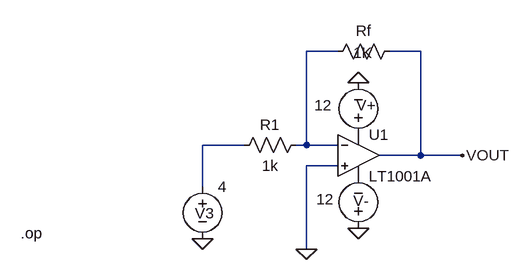
[diagram p0: schematic Inverting Amplifier.asc]
Inverting Amplifier.asc, the LTspice schematic file:
Version 4
SHEET 1 880 680
WIRE 224 16 176 16
WIRE 352 16 304 16
WIRE 80 160 16 160
WIRE 176 160 176 16
WIRE 176 160 160 160
WIRE 224 160 176 160
WIRE 352 176 352 16
WIRE 352 176 288 176
WIRE 416 176 352 176
WIRE 224 192 176 192
WIRE 16 224 16 160
WIRE 176 320 176 192
FLAG 256 288 0
FLAG 16 304 0
FLAG 256 64 0
FLAG 176 320 0
FLAG 416 176 VOUT
SYMBOL OpAmps\\LT1001A 256 112 R0
SYMATTR InstName U1
SYMBOL voltage 256 304 R180
WINDOW 0 -16 58 Left 2
WINDOW 3 38 61 Left 2
WINDOW 123 0 0 Left 0
WINDOW 39 0 0 Left 0
SYMATTR InstName V-
SYMATTR Value 12
SYMBOL voltage 256 160 R180
WINDOW 0 -27 61 Left 2
WINDOW 3 41 61 Left 2
WINDOW 123 0 0 Left 0
WINDOW 39 0 0 Left 0
SYMATTR InstName V+
SYMATTR Value 12
SYMBOL voltage 16 208 R0
WINDOW 0 -12 57 Left 2
WINDOW 3 24 16 Left 2
WINDOW 123 0 0 Left 0
WINDOW 39 0 0 Left 0
SYMATTR InstName V3
SYMATTR Value 4
SYMBOL res 176 144 R90
WINDOW 0 0 56 VBottom 2
WINDOW 3 32 56 VTop 2
SYMATTR InstName R1
SYMATTR Value 1k
SYMBOL res 320 0 R90
WINDOW 0 0 56 VBottom 2
WINDOW 3 2 57 VTop 2
SYMATTR InstName Rf
SYMATTR Value 1K
TEXT -264 296 Left 2 !.op

The netlist it stands for:
* Inverting Amplifier.asc
XU1 0 N001 P001 P002 VOUT LT1001  ; LT1001A, pins In+ In- V+ V- OUT
V- 0 P002 12
V+ P001 0 12
V3 N002 0 4
R1 N001 N002 1k
Rf VOUT N001 1K
.op
.lib LTC.lib
.backanno
.end